# EAGLE design dualshock_c64_adapter (EAGLE 9.6.2)
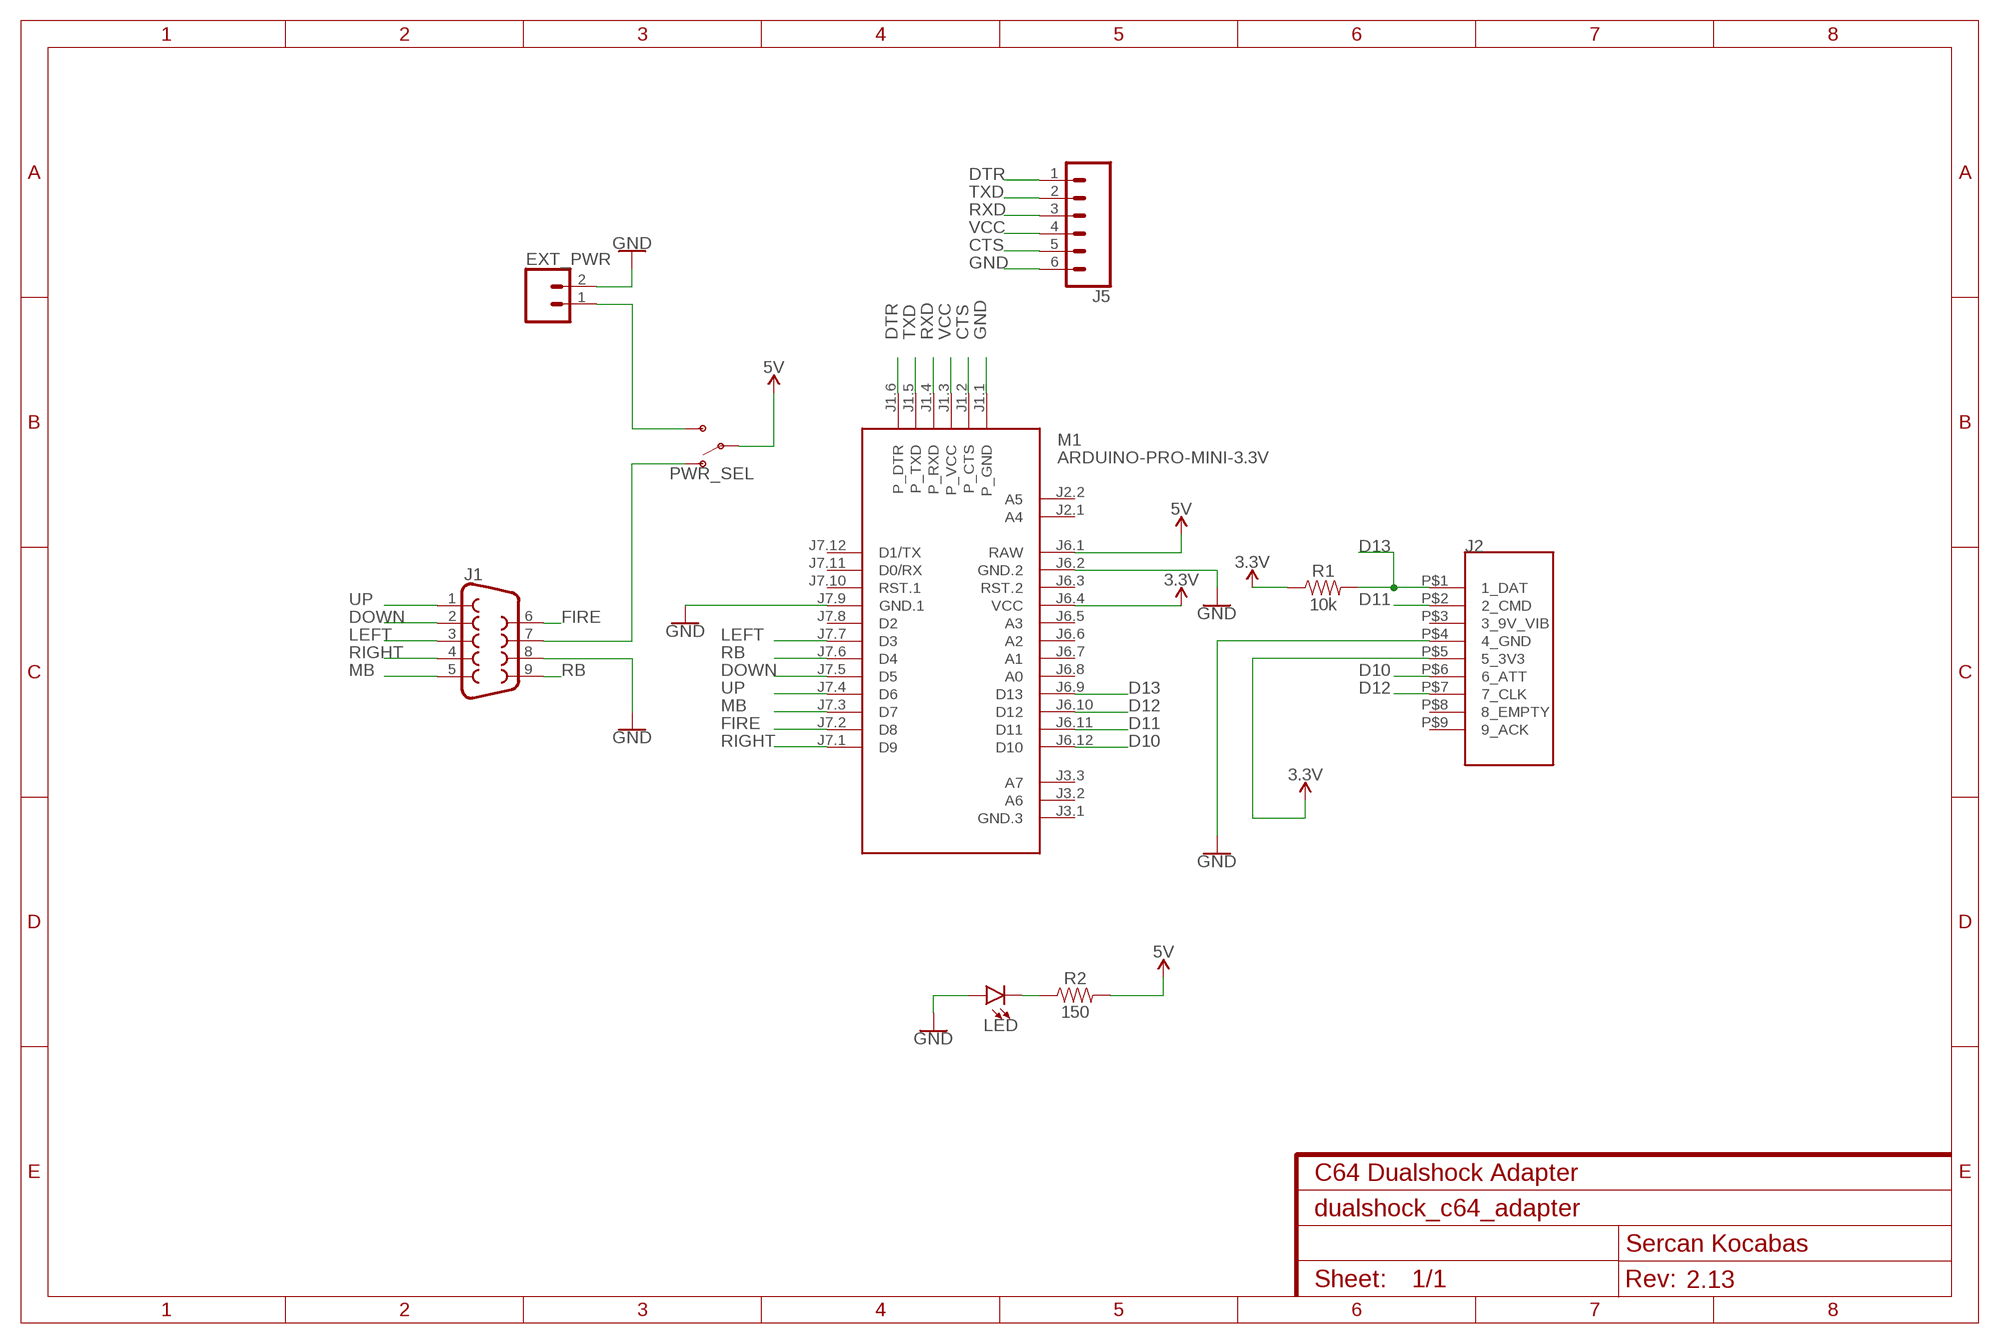
[diagram p0: schematic, sheet 1]
FRAME1 (FRAME-A4L): CNAME: C64 Dualshock Adapter; CREVISION: 2.13; DESIGNER: Sercan Kocabas

## Parts
EXT_PWR  CONN_02  [1X02]
J1  DB9FEMALE  [DB9]
J2  PS2_DUALSHOCK  [PS2_DUALSHOCK]
J5  CONN_06NO_SILK_FEMALE_PTH  [1X06_NO_SILK]
LED  LED5MM  [LED_5MM]
M1  ARDUINO-PRO-MINI-3.3V  [ARDUINO-PRO-MINI]
PWR_SEL  SWITCH-SPDT-PTH-11.6X4.0MM  [SWITCH_SPDT_PTH_11.6X4.0MM]
R1  10k  10KOHM-HORIZ-1/4W-1%  [AXIAL-0.3]
R2  150  10KOHM-HORIZ-1/4W-1%  [AXIAL-0.3]

## Nets
3.3V: J2.P$5(5_3V3) M1.J6.4(VCC) R1.P$1
5V: M1.J6.1(RAW) PWR_SEL.2(P) R2.P$2
CTS: J5.5 M1.J1.2(P_CTS)
D10: J2.P$6(6_ATT) M1.J6.12(D10)
D11: J2.P$2(2_CMD) M1.J6.11(D11)
D12: J2.P$7(7_CLK) M1.J6.10(D12)
D13: J2.P$1(1_DAT) M1.J6.9(D13) R1.P$2
DOWN: J1.2 M1.J7.5(D5)
DTR: J5.1 M1.J1.6(P_DTR)
FIRE: J1.6 M1.J7.2(D8)
GND: EXT_PWR.2 J1.8 J2.P$4(4_GND) J5.6 LED.A M1.J1.1(P_GND) M1.J6.2(GND.2) M1.J7.9(GND.1)
LEFT: J1.3 M1.J7.7(D3)
MB: J1.5 M1.J7.3(D7)
N$1: LED.K(C) R2.P$1
N$2: J1.7 PWR_SEL.1(O)
N$3: EXT_PWR.1 PWR_SEL.3(S)
RB: J1.9 M1.J7.6(D4)
RIGHT: J1.4 M1.J7.1(D9)
RXD: J5.3 M1.J1.4(P_RXD)
TXD: J5.2 M1.J1.5(P_TXD)
UP: J1.1 M1.J7.4(D6)
VCC: J5.4 M1.J1.3(P_VCC)
Unconnected: J2.P$3(3_9V_VIB) J2.P$8(8_EMPTY) J2.P$9(9_ACK) M1.J2.1(A4) M1.J2.2(A5) M1.J3.1(GND.3) M1.J3.2(A6) M1.J3.3(A7) M1.J6.3(RST.2) M1.J6.5(A3) M1.J6.6(A2) M1.J6.7(A1) M1.J6.8(A0) M1.J7.8(D2) M1.J7.10(RST.1) M1.J7.11(D0/RX) M1.J7.12(D1/TX)

## Library data of the parts
EXT_PWR = SparkFun-Connectors:CONN_02: Multi connection point. Often used as Generic Header-pin footprint for 0.1 inch spaced/style header connections On any of the 0.1 inch spaced packages, you can populate with these: Break Away Headers - Straight <https://www.sparkfun.com/products/116> (PRT-00116) Break Away Male Headers - Right Angle <https://www.sparkfun.com/products/553> (PRT-00553) Female Headers <https://www.sparkfun.com/products/115> (PRT-00115) Break Away Headers - Machine Pin <https://www.sparkfun.com/products/117> (PRT-00117) Break Away Female Headers - Swiss Machine Pin <https://www.sparkfun.com/products/743> (PRT-00743) For SCREWTERMINALS and SPRING TERMINALS visit here: Screw Terimnals on SparkFun.com <https://www.sparkfun.com/search/results?term=Screw+Terminals> (5mm/3.5mm/2.54mm spacing) This device is also useful as a general connection point to wire up your design to another part of your project. Our various solder wires solder well into these plated through hole pads. Hook-Up Wire - Assortment (Stranded, 22 AWG) <https://www.sparkfun.com/products/11375> (PRT-11375) Hook-Up Wire - Assortment (Solid Core, 22 AWG) <https://www.sparkfun.com/products/11367> (PRT-11367) View the entire wire category on our website here <https://www.sparkfun.com/categories/141> Special notes: Molex polarized connector foot print use with: PRT-08233 with associated crimp pins and housings. 2.54_SCREWTERM for use with PRT-10571. 3.5mm Screw Terminal footprints for PRT-08084 5mm Screw Terminal footprints for use with PRT-08432
J1 = SparkFun-Connectors:DB9: DB9 Connector Standard DB9 (D-Sub 9) serial connector. Can be used for CAN bus as well as RS485 and RS232. Footprint production proven. Here is the female version connector we sell at SparkFun: 9 Pin Female Serial Connector - PCB Mount <https://www.sparkfun.com/products/429> (PRT-00429) This connector has been used on the following SparkFun products: SparkFun RS232 Shifter - SMD <https://www.sparkfun.com/products/449> (PRT-00449) SparkFun RS232 Shifter SMD (No DB9) <https://www.sparkfun.com/products/8780> (PRT-08780); PROD_ID: CONN-08194
J2 = seco_lib:PS2_DUALSHOCK
J5 = SparkFun-Connectors:CONN_06: Multi connection point. Often used as Generic Header-pin footprint for 0.1 inch spaced/style header connections On any of the 0.1 inch spaced packages, you can populate with these: Break Away Headers - Straight <https://www.sparkfun.com/products/116> (PRT-00116) Break Away Male Headers - Right Angle <https://www.sparkfun.com/products/553> (PRT-00553) Female Headers <https://www.sparkfun.com/products/115> (PRT-00115) Break Away Headers - Machine Pin <https://www.sparkfun.com/products/117> (PRT-00117) Break Away Female Headers - Swiss Machine Pin <https://www.sparkfun.com/products/743> (PRT-00743) Arduino Stackable Header - 6 Pin <https://www.sparkfun.com/products/9280> (PRT-09280) For SCREWTERMINALS and SPRING TERMINALS visit here: Screw Terimnals on SparkFun.com <https://www.sparkfun.com/search/results?term=Screw+Terminals> (5mm/3.5mm/2.54mm spacing) This device is also useful as a general connection point to wire up your design to another part of your project. Our various solder wires solder well into these plated through hole pads. Hook-Up Wire - Assortment (Stranded, 22 AWG) <https://www.sparkfun.com/products/11375> (PRT-11375) Hook-Up Wire - Assortment (Solid Core, 22 AWG) <https://www.sparkfun.com/products/11367> (PRT-11367) View the entire wire category on our website here <https://www.sparkfun.com/categories/141>; PROD_ID: CONN-08437
LED = SparkFun-LED:LED: LED (Generic) Standard schematic elements and footprints for 5mm, 3mm, 1206, and 0603 sized LEDs. Generic LEDs with no color specified.
M1 = diy-modules:ARDUINO-PRO-MINI-*: Arduino Pro Mini and compatible devices More details available here: https://www.arduino.cc/en/Main/ArduinoBoardProMini Click here to find device on ebay.com <http://www.ebay.com/sch/arduino+pro+mini>
PWR_SEL = SparkFun-Switches:SWITCH-SPDT: Single Pole, Double Throw (SPDT) Switch Single-pole, double-throw (SPDT) switch. Variant Overview SMD-AYZ0202 Surface Mount DPDT Switch <https://www.sparkfun.com/products/597> (COM-00597) Used on e.g. LilyPad Arduino USB - ATmega32U4 Board <https://www.sparkfun.com/products/12049> PTH-11.6X4.0MM SPDT Mini Power Switch <https://www.sparkfun.com/products/102> (COM-00102) Used on e.g. SparkFun Simon Says - Through-Hole Soldering Kit <https://www.sparkfun.com/products/10547> (KIT-10547) PTH-11.6X4.0MM-KIT KIT version of SPDT Mini Power Switch - Simplifies soldering by removing tStop of switch pins - only one side can be soldered. PTH-11.6X4.0MM-LOCK LOCK version of SPDT Mini Power Switch - Offset pins hold switch in place for easier soldering. SMD-RIGHT-ANGLE Surface Mount Right Angle Switch <https://www.sparkfun.com/products/10860> (COM-10860) Used on e.g. SparkFun ESP8266 Thing <https://www.sparkfun.com/products/13231>; PROD_ID: SWCH-08261; SF_SKU: COM-00102
R1 = SparkFun-Resistors:10KOHM: 10kΩ resistor A resistor is a passive two-terminal electrical component that implements electrical resistance as a circuit element. Resistors act to reduce current flow, and, at the same time, act to lower voltage levels within circuits. - Wikipedia; PROD_ID: RES-12183
R2 = SparkFun-Resistors:10KOHM: 10kΩ resistor A resistor is a passive two-terminal electrical component that implements electrical resistance as a circuit element. Resistors act to reduce current flow, and, at the same time, act to lower voltage levels within circuits. - Wikipedia; PROD_ID: RES-12183; VALUE: 10k

## Board
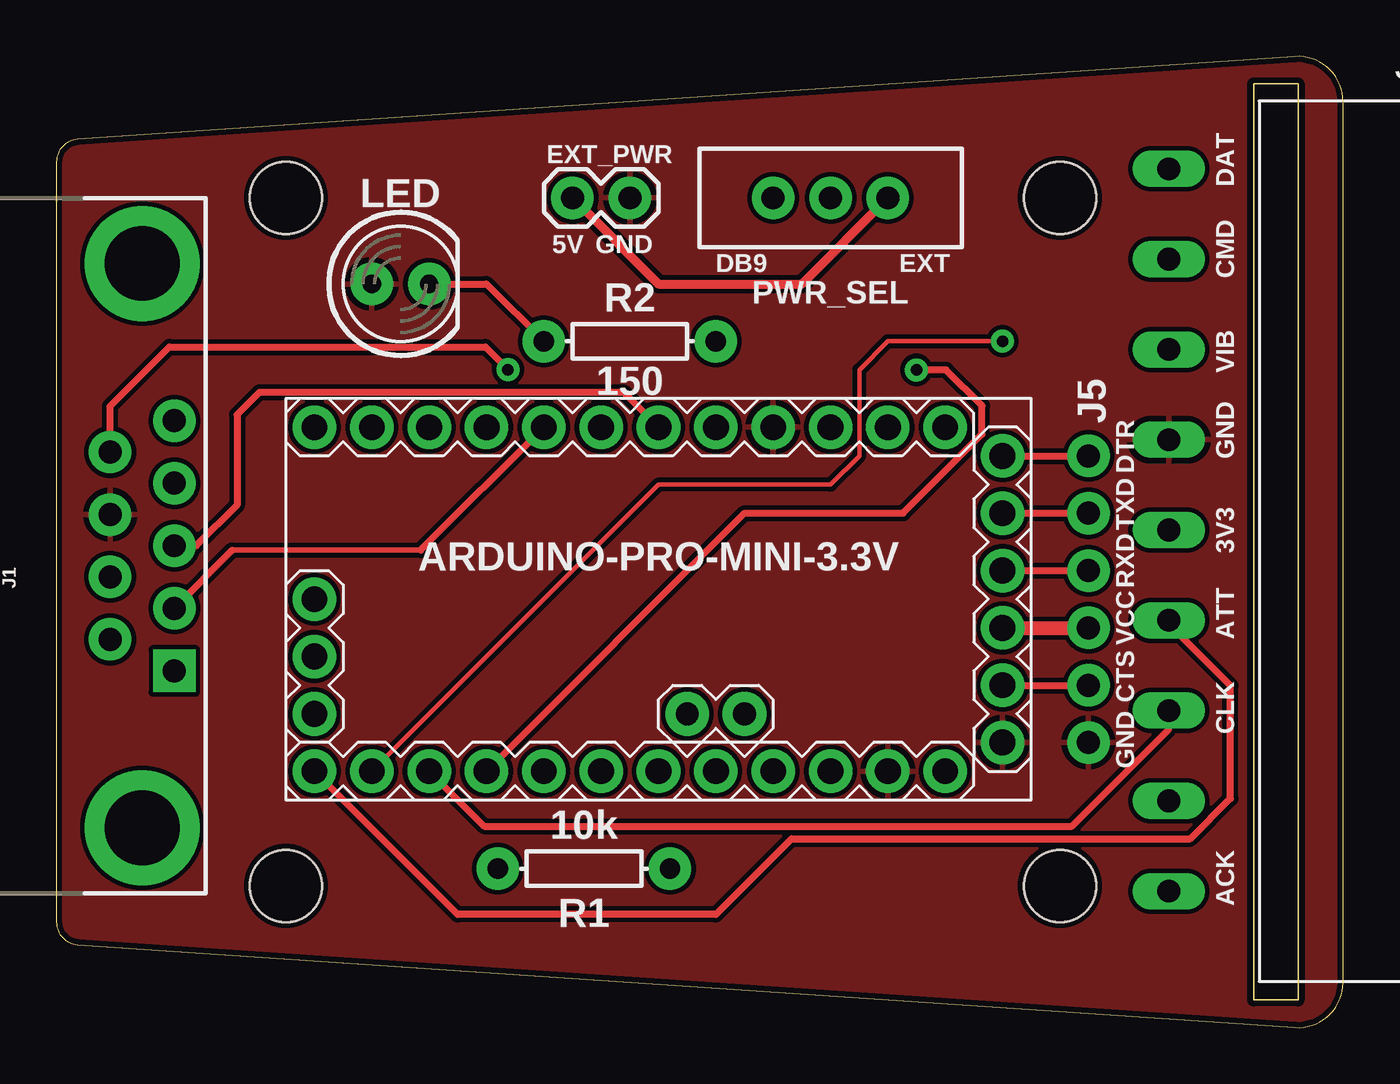
[diagram p1: board, top side]
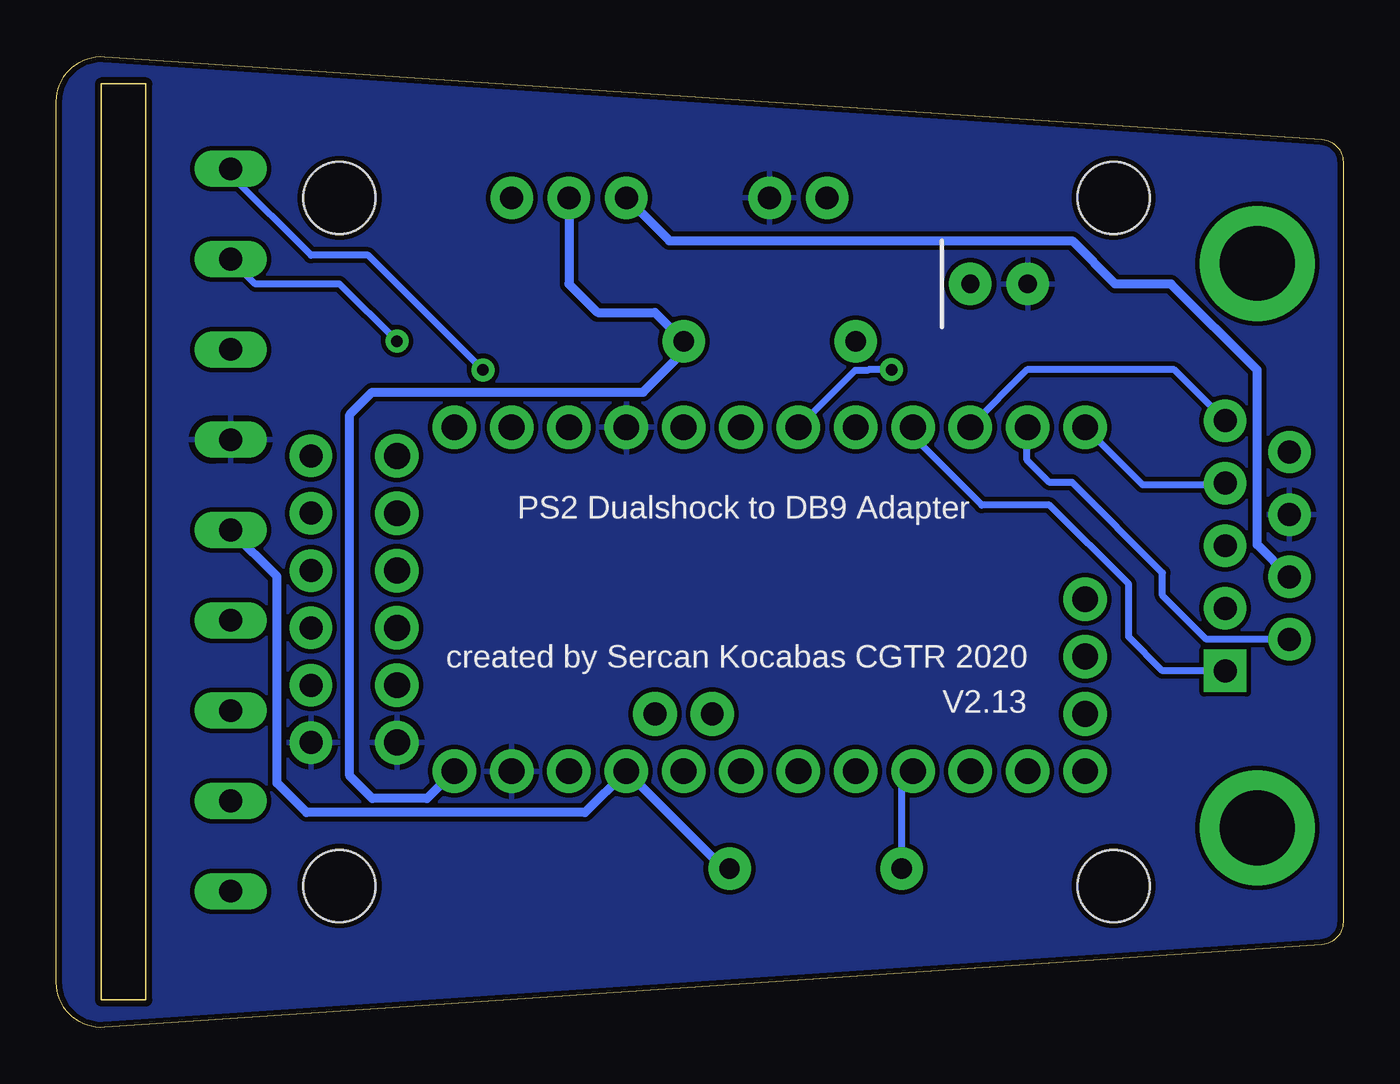
[diagram p2: board, bottom side, seen from below]

Size 56.99 x 43.02 mm. Coordinates in mm from the lower left corner, seen from the top.
Outline: 56.99,2 56.99,41.02 arc94 54.86,43.02 0.93,39.35 arc86 0,38.35 0,4.67 arc86 0.93,3.67 54.86,0 arc94 56.99,2
Outline: 55,1.23 53.03,1.23 53.03,41.81 55,41.81 55,1.23
Copper layers (1*16): Top 0.035mm / dielectric 1.5mm / Bottom 0.035mm
Design rules "SparkFun": minimum track width 8mil, minimum drill 20mil, track to track 8mil, track to pad 8mil, pad to pad 8mil, via to via 8mil, smd to smd 8mil, copper to edge 10mil, drill to drill 8mil, minimum pad ring 12mil, minimum via ring 10mil, stop-mask expansion 4mil, vias tented up to drill 25mil, thermal gap 10mil
Holes 3.2 mm at 10.16,6.28 44.45,6.28 44.45,36.76 10.16,36.76

### Footprints (pad centres in the part's own frame; a part is rotated, then mirrored left to right if it is on the bottom)
1X02 = drill 1.016 pad 1.88: 1 0,0; 2 2.54,0
DB9 = drill 1.016 pad 1.88 square: 1 -5.54,-1.42 | drill 1.016 pad 1.88: 2 -2.77,-1.42; 3 0,-1.42; 4 2.77,-1.42; 5 5.54,-1.42; 6 -4.15,1.42; 7 -1.38,1.42; 8 1.38,1.42; 9 4.15,1.42 | drill 3.302 pad 5.08: G1 -12.5,0; G2 12.5,0
PS2_DUALSHOCK = drill 1 long: P$1 0,7; P$2 0,3; P$3 0,-1; P$4 0,-5; P$5 0,-9; P$6 0,-13; P$7 0,-17; P$8 0,-21; P$9 0,-25
1X06_NO_SILK = drill 1.016 pad 1.88: 1 0,0; 2 2.54,0; 3 5.08,0; 4 7.62,0; 5 10.16,0; 6 12.7,0
LED_5MM = drill 0.813 pad 1.88: A -1.27,0; K 1.27,0
ARDUINO-PRO-MINI = drill 1.143 pad 1.93: J1.1 -15.24,6.35; J1.2 -15.24,3.81; J1.3 -15.24,1.27; J1.4 -15.24,-1.27; J1.5 -15.24,-3.81; J1.6 -15.24,-6.35; J3.1 15.24,0; J3.2 15.24,2.54; J3.3 15.24,5.08; J6.1 -12.7,7.62; J6.2 -10.16,7.62; J6.3 -7.62,7.62; J6.4 -5.08,7.62; J6.5 -2.54,7.62; J6.6 0,7.62; J6.7 2.54,7.62; J6.8 5.08,7.62; J6.9 7.62,7.62; J6.10 10.16,7.62; J6.11 12.7,7.62; J6.12 15.24,7.62; J7.1 15.24,-7.62; J7.2 12.7,-7.62; J7.3 10.16,-7.62; J7.4 7.62,-7.62; J7.5 5.08,-7.62; J7.6 2.54,-7.62; J7.7 0,-7.62; J7.8 -2.54,-7.62; J7.9 -5.08,-7.62; J7.10 -7.62,-7.62; J7.11 -10.16,-7.62; J7.12 -12.7,-7.62 | drill 1 pad 1.93: J2.1 -1.27,5.08; J2.2 -3.81,5.08
SWITCH_SPDT_PTH_11.6X4.0MM = drill 1.016 pad 1.88: 1 0,2.54; 2 0,0; 3 0,-2.54
AXIAL-0.3 = drill 0.9 pad 1.88: P$1 -3.81,0; P$2 3.81,0

### Placement (x,y rotation side)
EXT_PWR  22.86,36.76 0 top
J1  3.8,21.35 90 top
J2  49.28,31.04 0 top
J5  45.72,25.33 270 top
LED  15.24,32.95 0 top
M1  26.67,18.98 180 top
PWR_SEL  34.29,36.76 90 top
R1  23.37,7.04 180 top
R2  25.4,30.41 0 top

### Tracks (layer width: path | path; a pad name or v marks a point on that pad's centre or on a via)
3.3V
  Bottom 0.406: R1.P$1 27.43,7.04 M1.J6.4 33.58,9.52 45.92,9.52 47.23,10.83 47.23,19.97 49.28,22.02 J2.P$5
5V
  Bottom 0.406: PWR_SEL.2 34.29,32.95 33.02,31.68 30.48,31.68 R2.P$2 29.21,29.94 31,28.15 43,28.15 44,27.15 44,11.15 43,10.15 40.58,10.15 M1.J6.1
CTS
  Top 0.305: M1.J1.2 J5.5
D10
  Top 0.305: M1.J6.12 17.78,5.01 29.21,5.01 32.57,8.36 50.22,8.36 52,10.15 52,15.15 49.28,17.87 J2.P$6
D11  (via drill 0.51)
  Top 0.203: v41.91,30.41 36.83,30.41 35.56,29.14 35.56,26.15 35.56,25.33 34.29,24.06 26.67,24.06 M1.J6.11
  Bottom 0.305: v41.91,30.41 44.45,32.95 48.18,32.95 J2.P$2
D12
  Top 0.305: J2.P$7 49.28,13.21 44.98,8.92 18.95,8.92 M1.J6.10
D13  (via drill 0.51)
  Top 0.305: M1.J6.9 30.48,22.79 37.5,22.79 41,26.28 41,27.55 39.41,29.14 v38.1,29.14
  Bottom 0.305: R1.P$2 19.56,10.85 M1.J6.9 | v38.1,29.14 43.18,34.22 45.72,34.22 49.28,37.77 J2.P$1
DOWN
  Top 0.254: 7.79,21.15 16.14,21.15
  Top 0.305: J1.2 7.79,21.15 | 16.14,21.15 M1.J7.5
DTR
  Top 0.305: M1.J1.6 J5.1
FIRE
  Bottom 0.305: J1.6 6.05,17.2 8,19.15 8,20.15 12,24.15 13,24.15 14,25.15 14,26.57 M1.J7.2
GND
  pour Top: -1.27,43.11 -1.27,-0.07 57.15,-0.07 57.15,43.11
  pour Bottom: -2.54,44.38 -2.54,-1.34 58.42,-1.34 58.42,44.38
LEFT
  Top 0.305: J1.3 6.2,21.35 8,23.15 8,27.15 9,28.15 25.12,28.15 M1.J7.7
MB
  Bottom 0.305: J1.5 7.48,29.15 14,29.15 16.51,26.64 M1.J7.3
N$1
  Top 0.305: LED.K 19.05,32.95 R2.P$1
N$2
  Bottom 0.406: PWR_SEL.1 29.84,34.85 11.99,34.85 10.09,32.95 7.62,32.95 3.81,29.14 3.81,21.4 J1.7
N$3
  Top 0.406: EXT_PWR.1 26.67,32.95 33.02,32.95 PWR_SEL.3
RB  (via drill 0.51)
  Top 0.305: J1.9 2.38,27.53 5,30.15 19,30.15 v20,29.15
  Bottom 0.305: M1.J7.6 21.61,29.11 21.05,29.11 21.02,29.15 v20,29.15
RIGHT
  Bottom 0.305: M1.J7.1 8.89,24.06 5.28,24.06 J1.4
RXD
  Top 0.305: M1.J1.4 J5.3
TXD
  Top 0.305: M1.J1.5 J5.2
UP
  Bottom 0.203: 19.05,26.2 M1.J7.4
  Bottom 0.305: J1.1 8,15.81 9.5,17.31 9.5,19.65 13,23.15 16,23.15 19.05,26.2
VCC
  Top 0.61: M1.J1.3 J5.4

### Text on the board
tPlace: DAT | 5V | GND | DB9 | EXT | CMD | VIB | GND | DTR | TXD | 3V3 | RXD | VCC | ATT | CTS | CLK | GND | ACK
bPlace: PS2 Dualshock to DB9 Adapter | created by Sercan Kocabas CGTR 2020 | V2.13